# EAGLE schematic pchub (EAGLE 9.0.0)
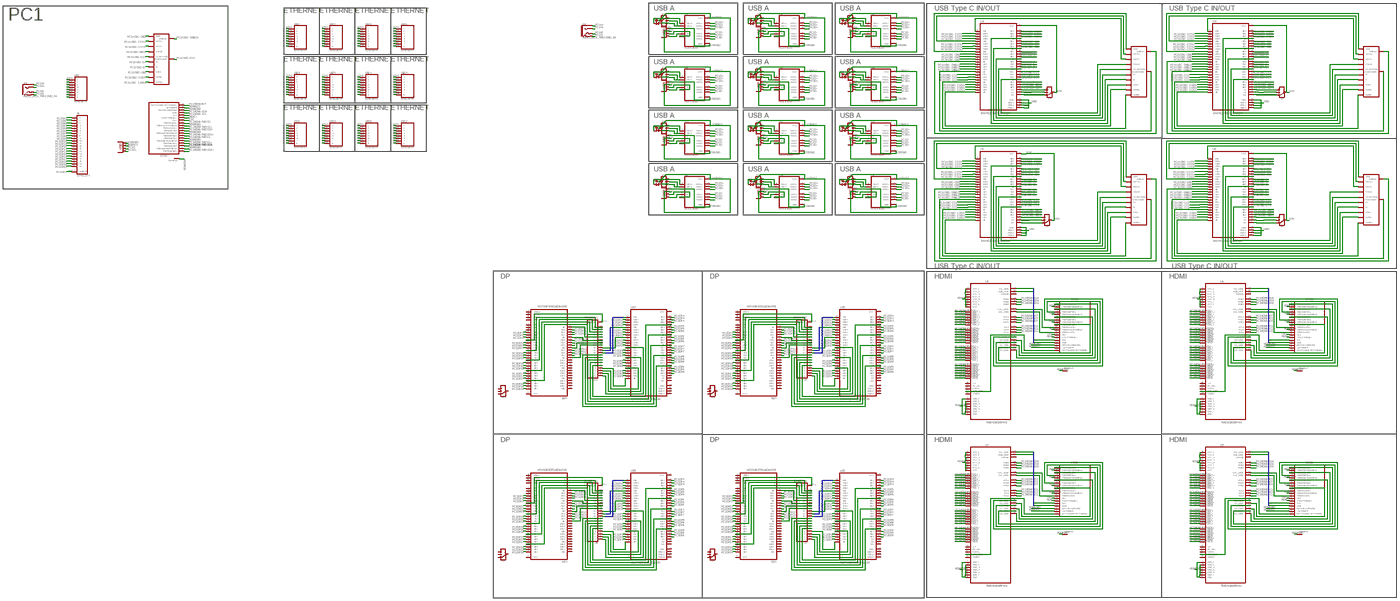
[diagram p0: schematic, sheet 1, overview]
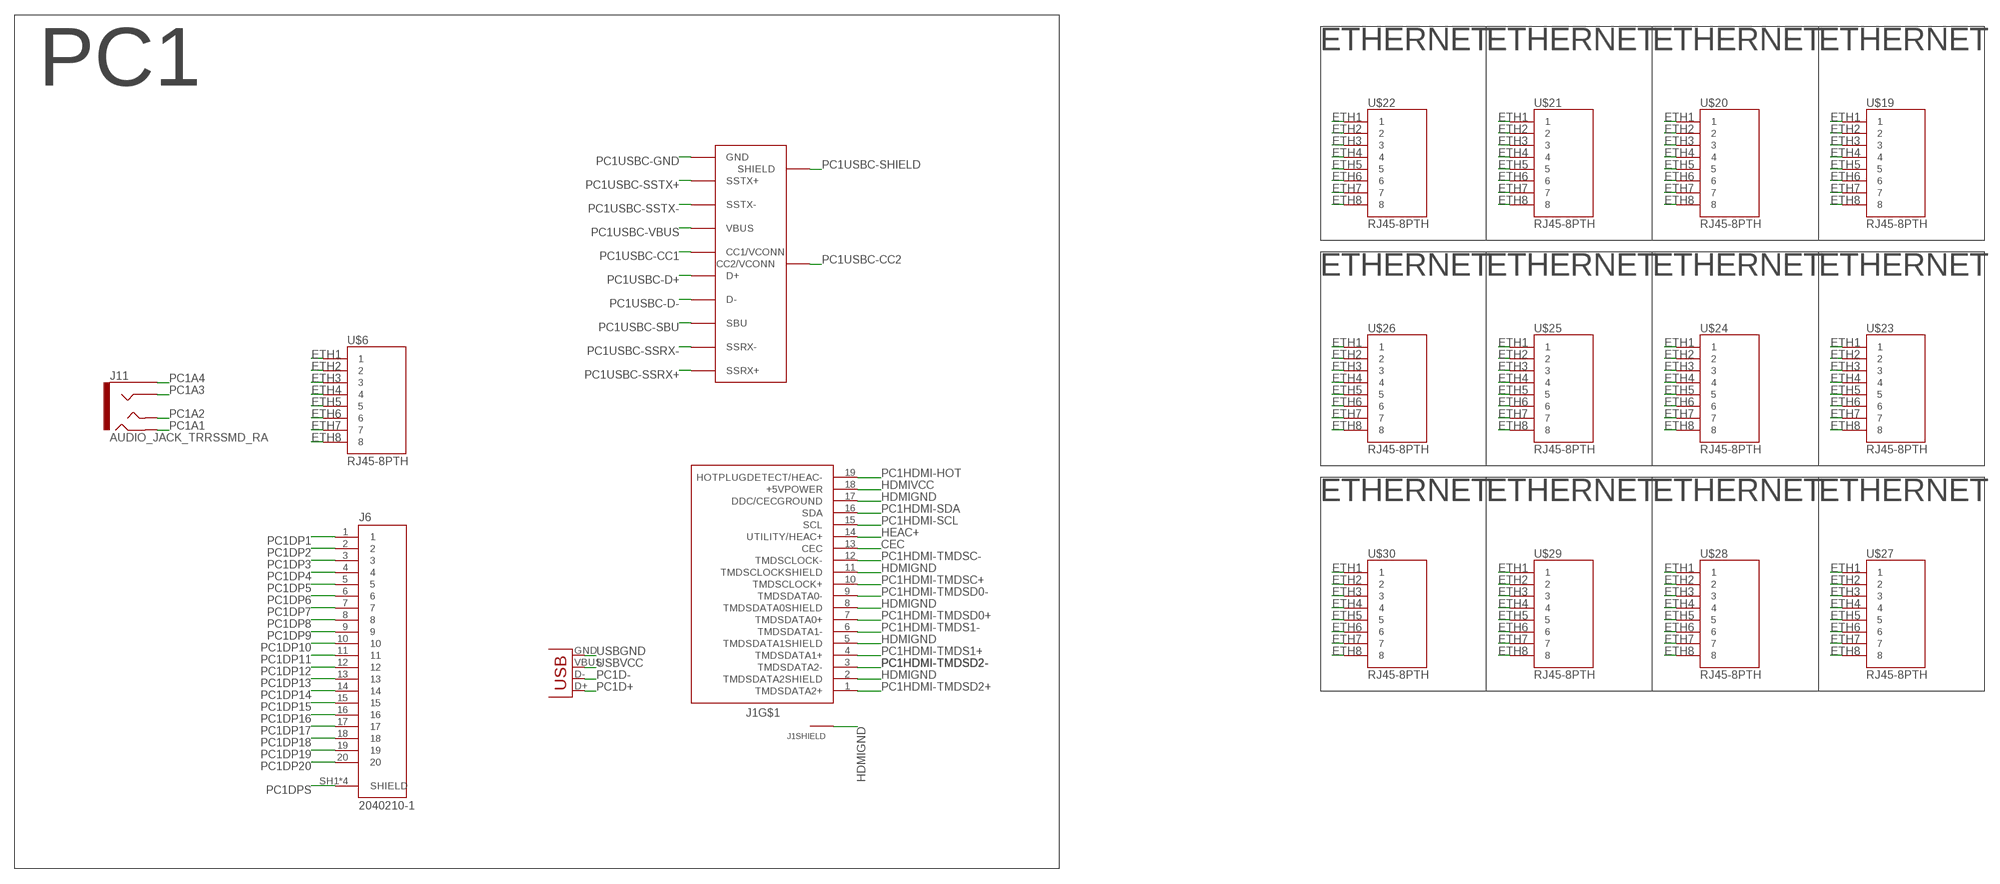
[diagram p1: schematic, sheet 1, part 1 of 5]
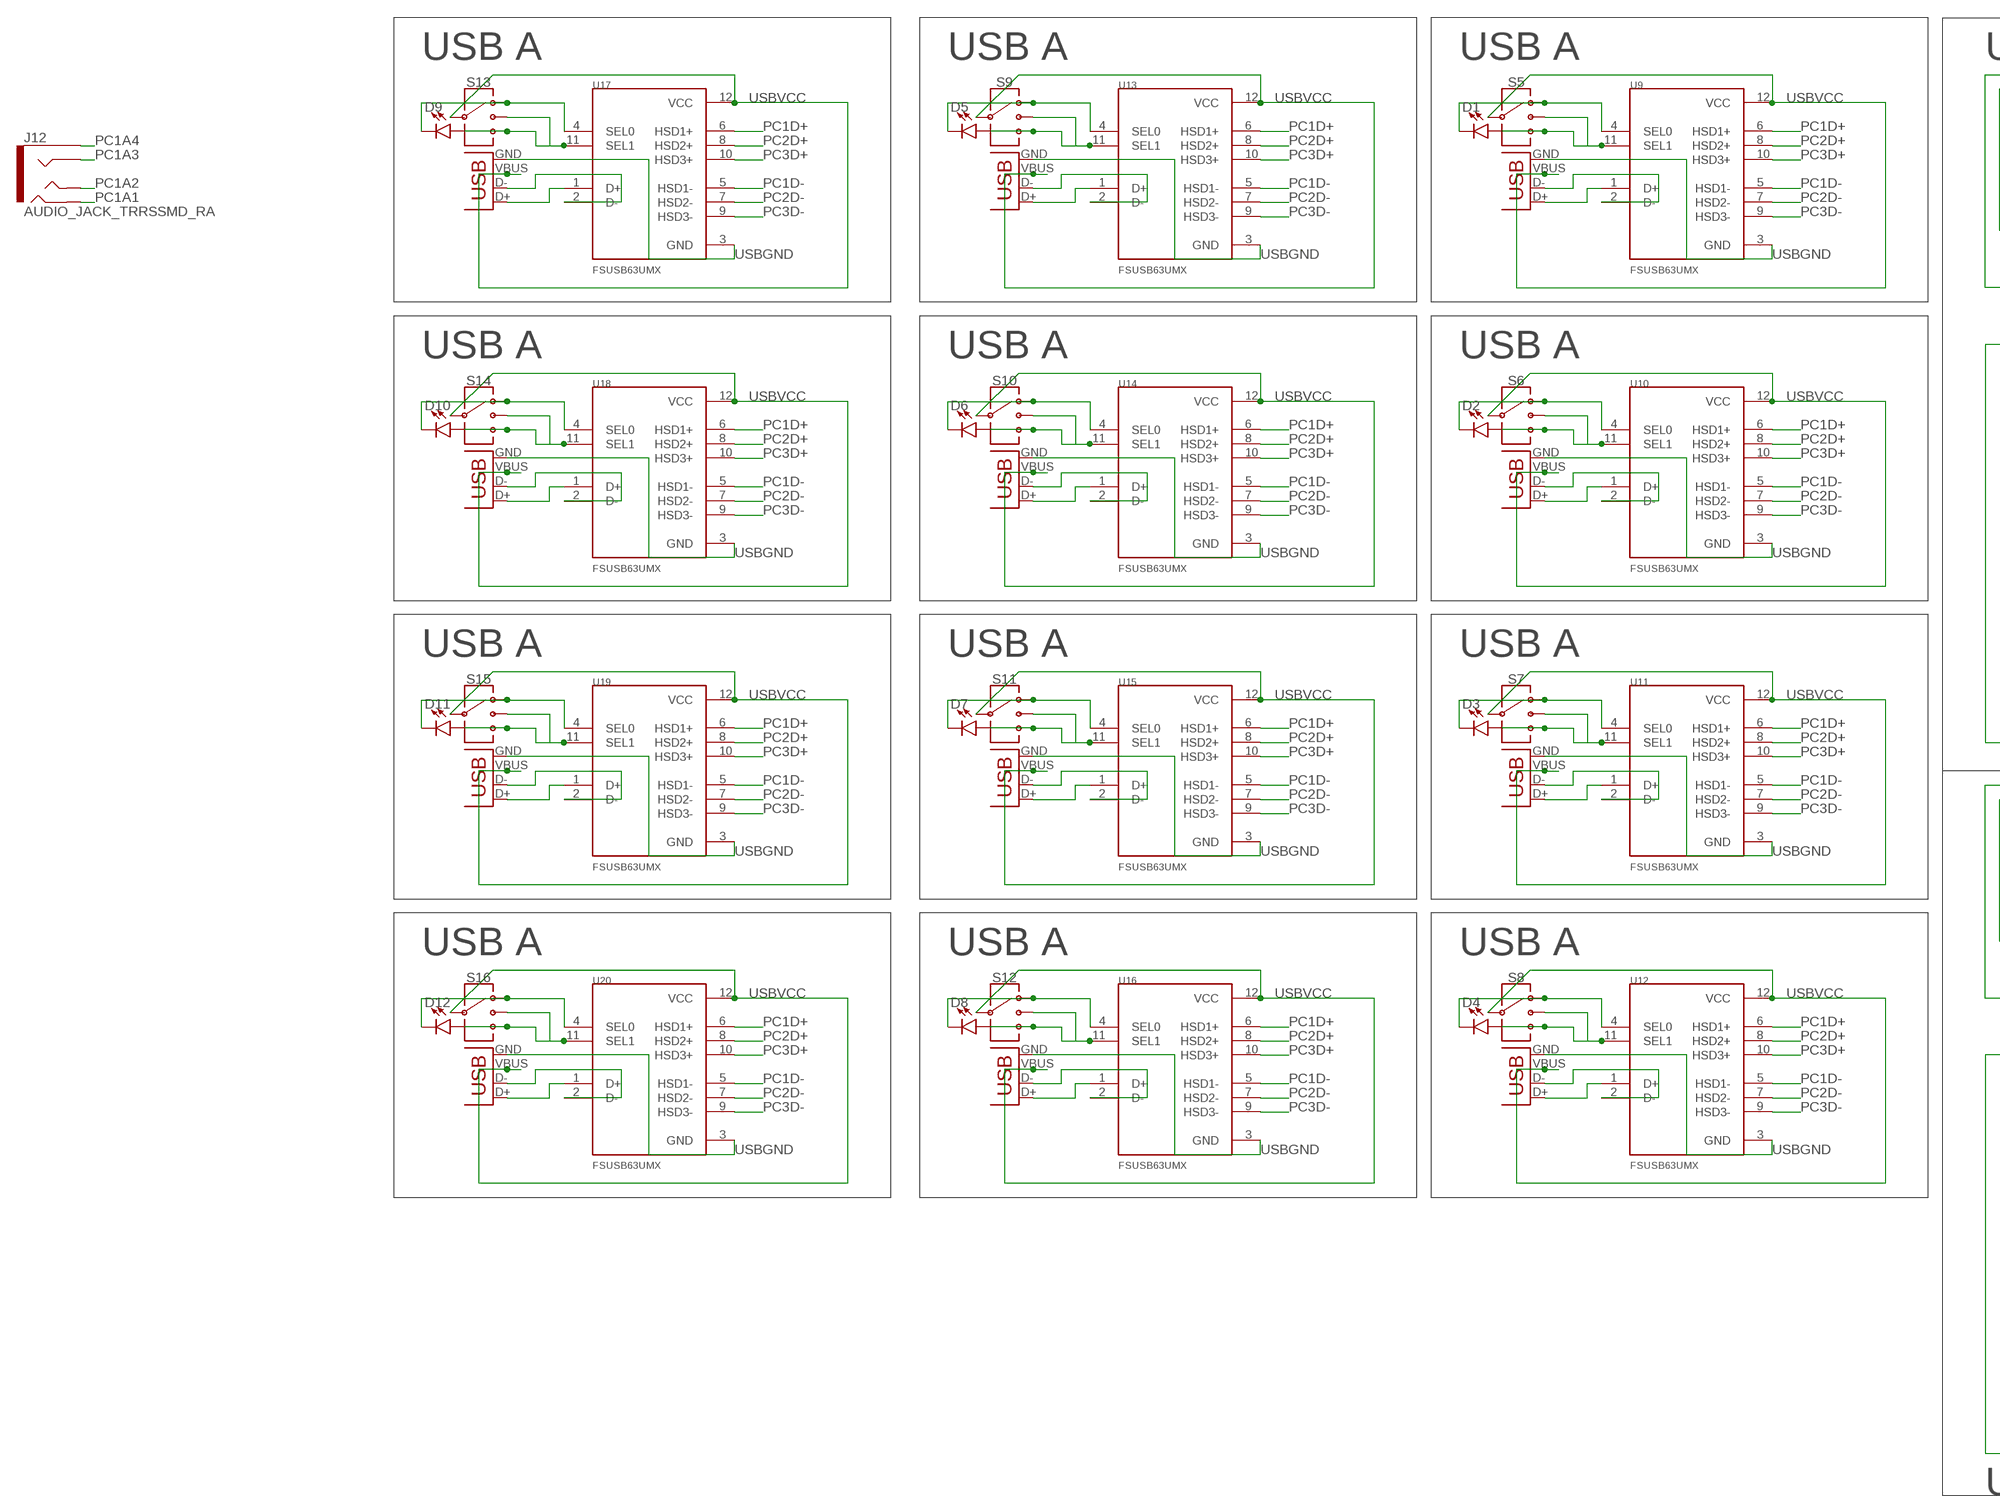
[diagram p2: schematic, sheet 1, part 2 of 5]
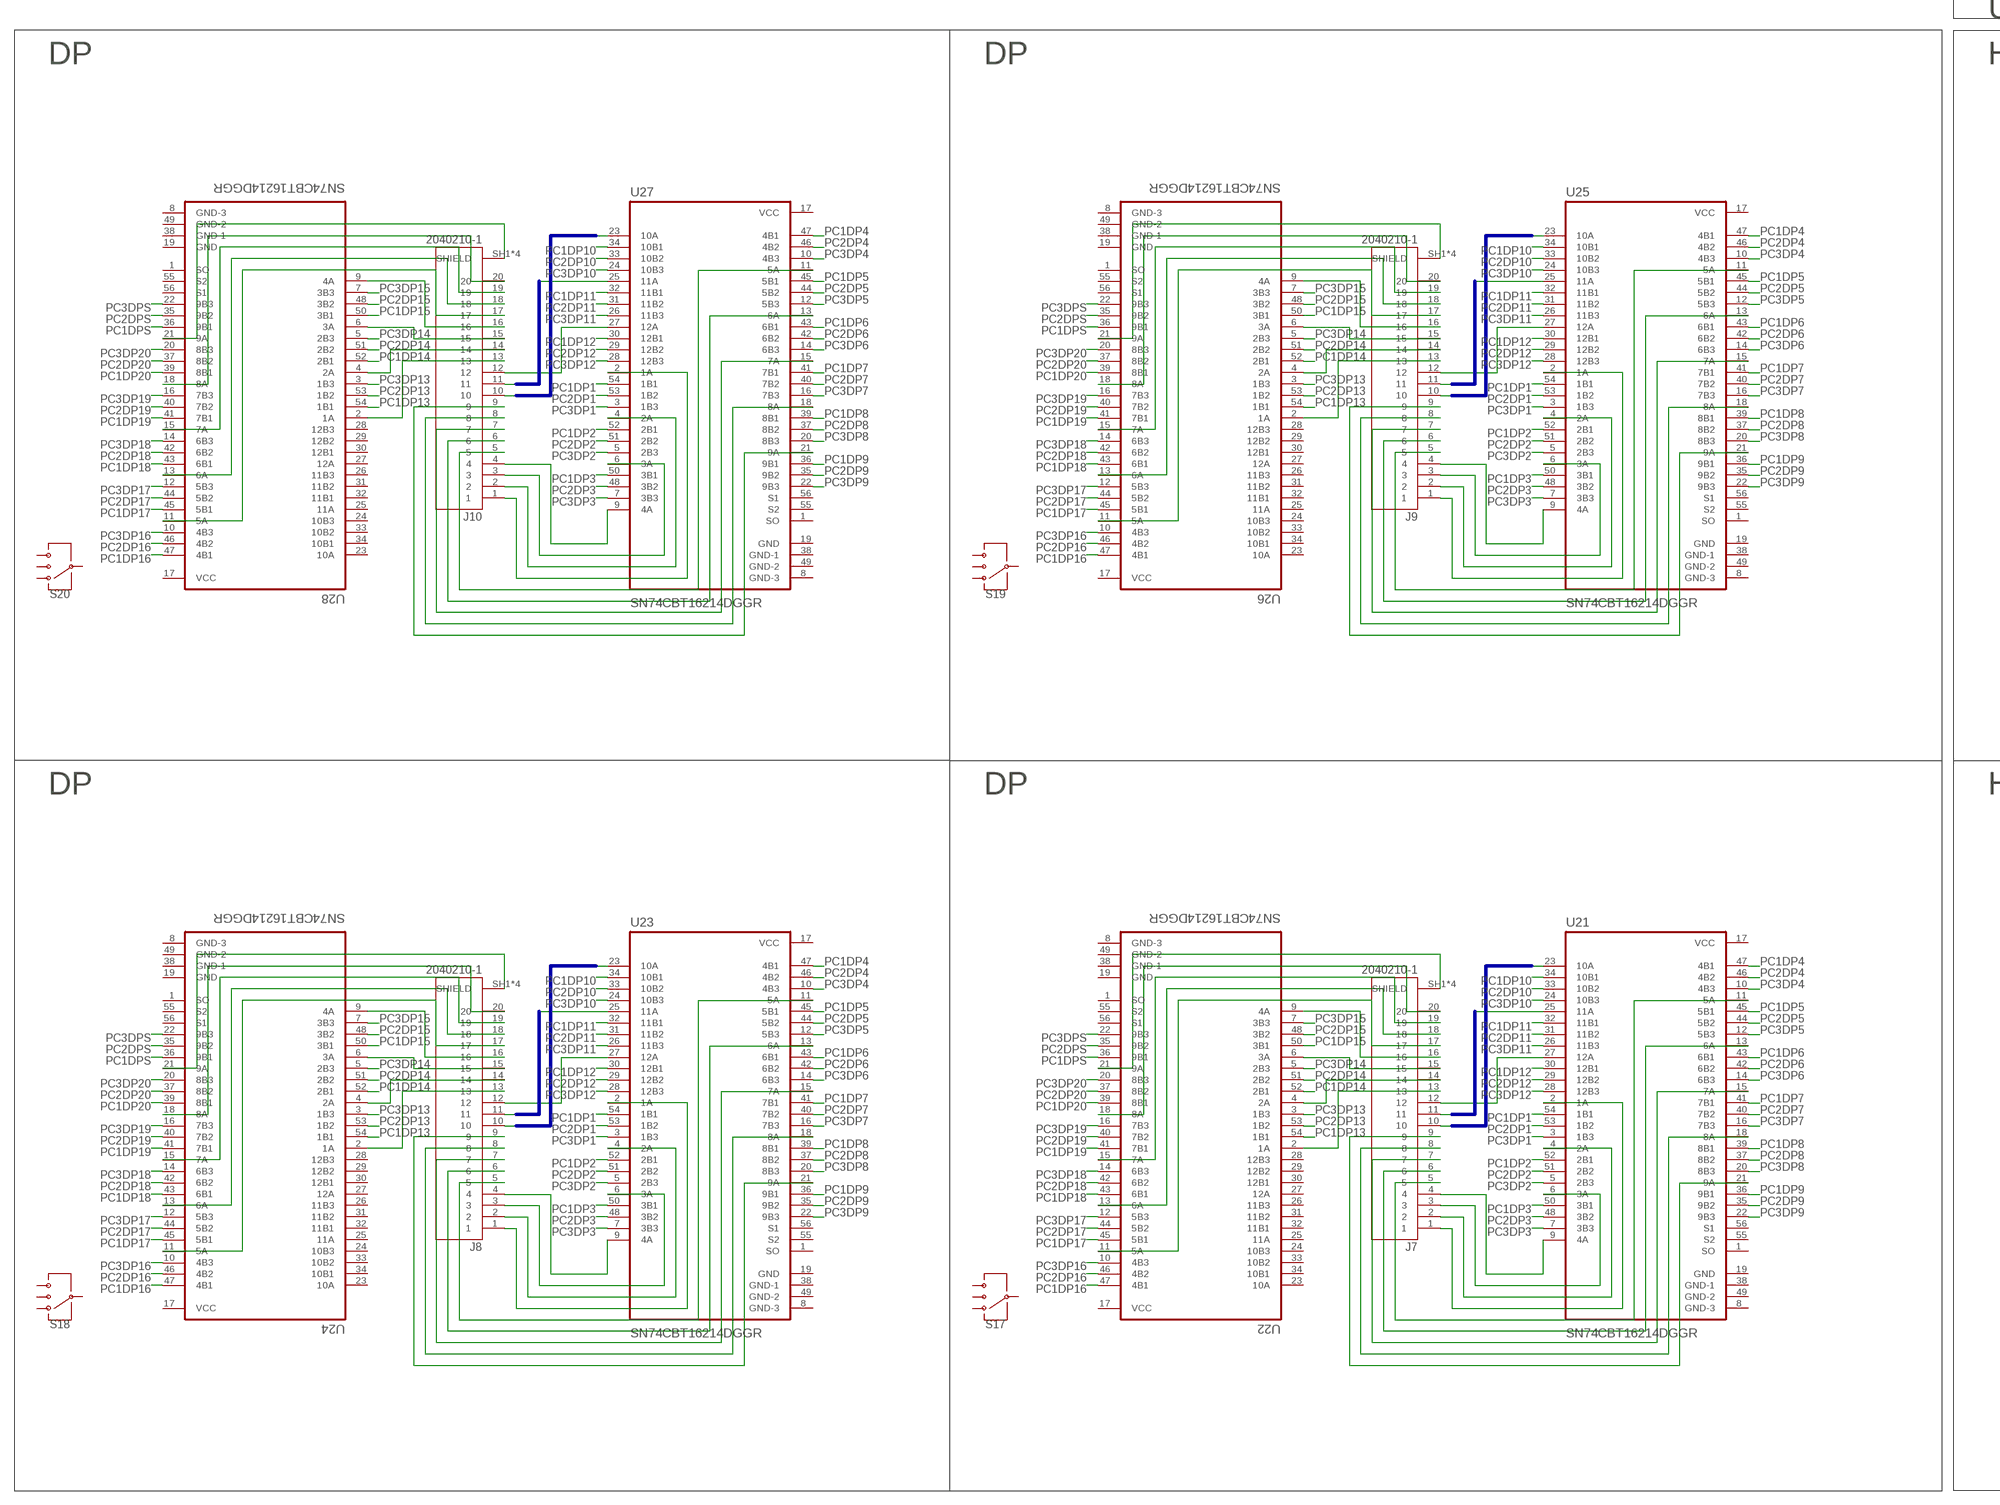
[diagram p3: schematic, sheet 1, part 3 of 5]
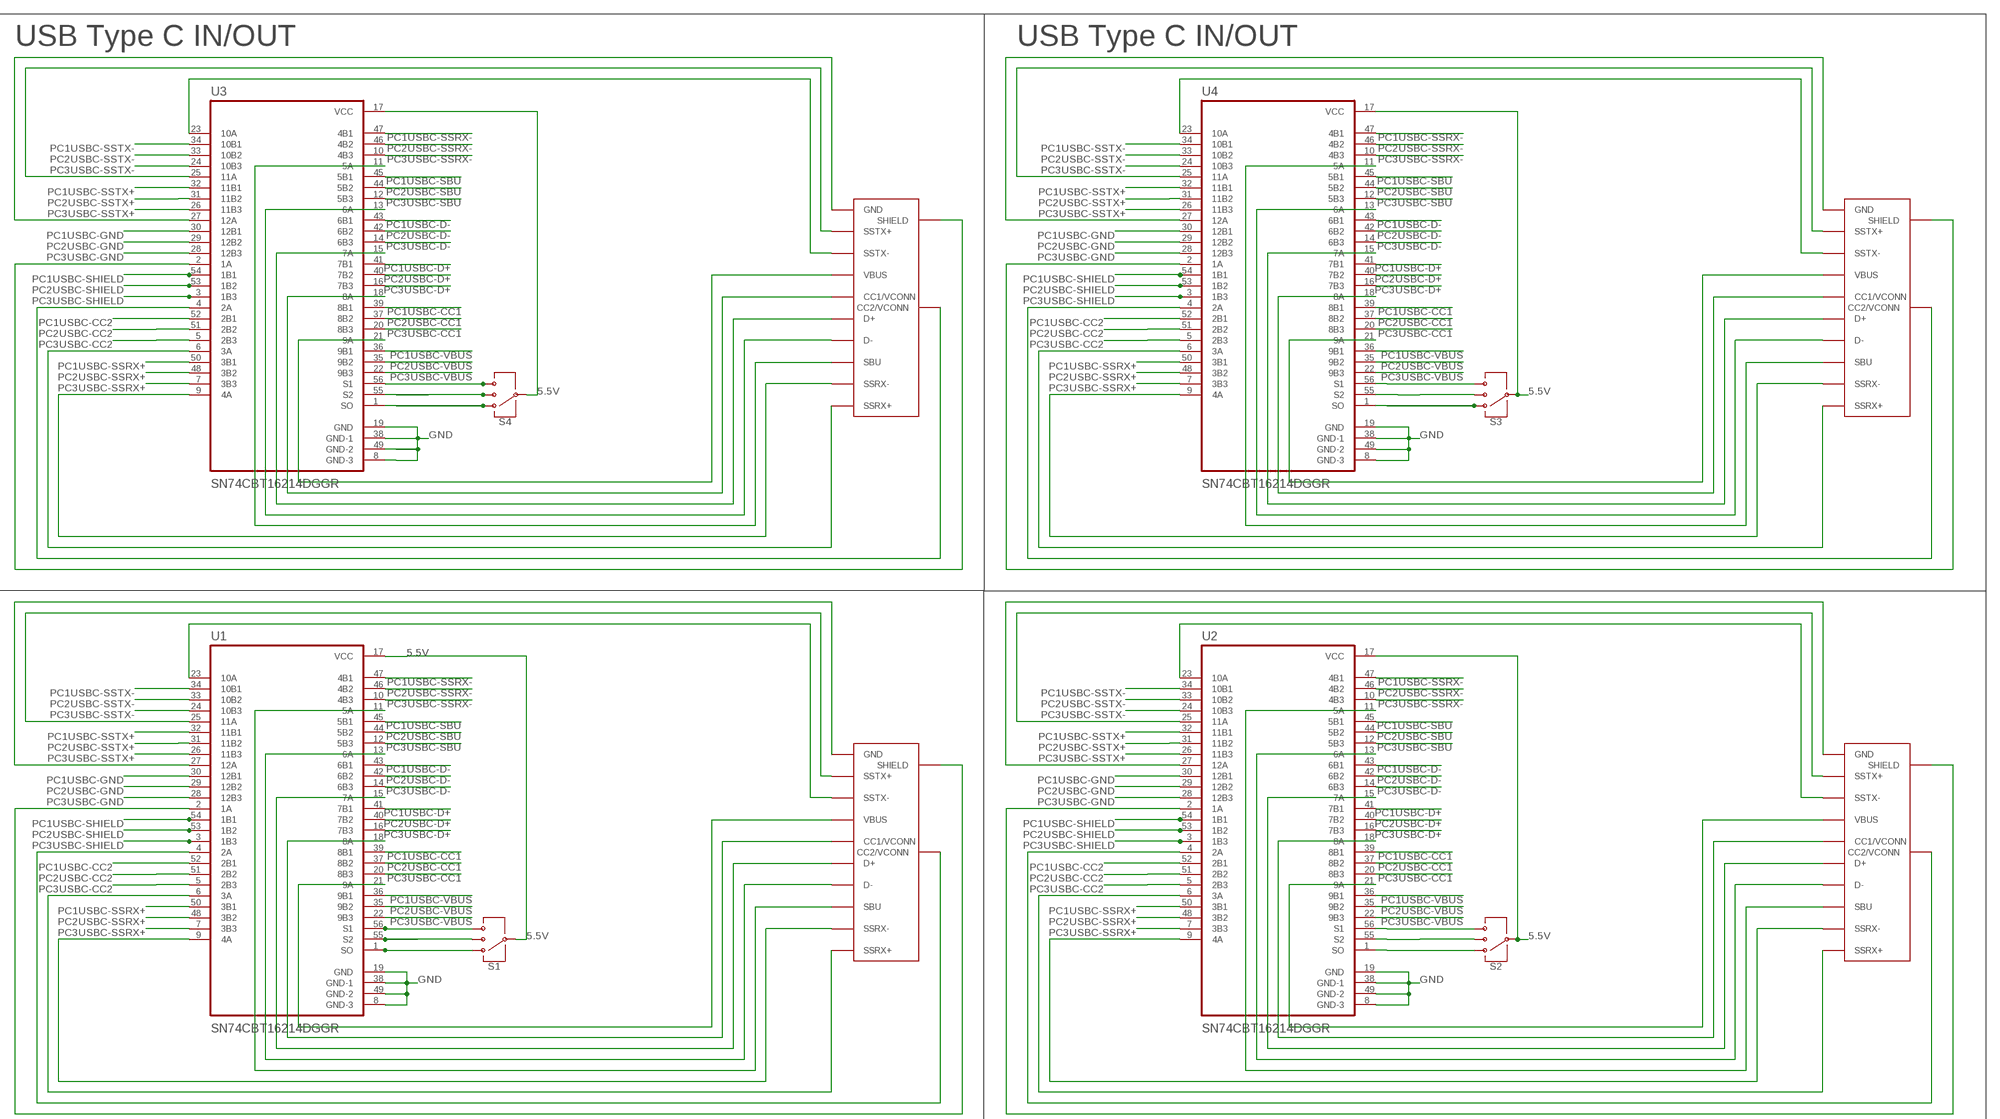
[diagram p4: schematic, sheet 1, part 4 of 5]
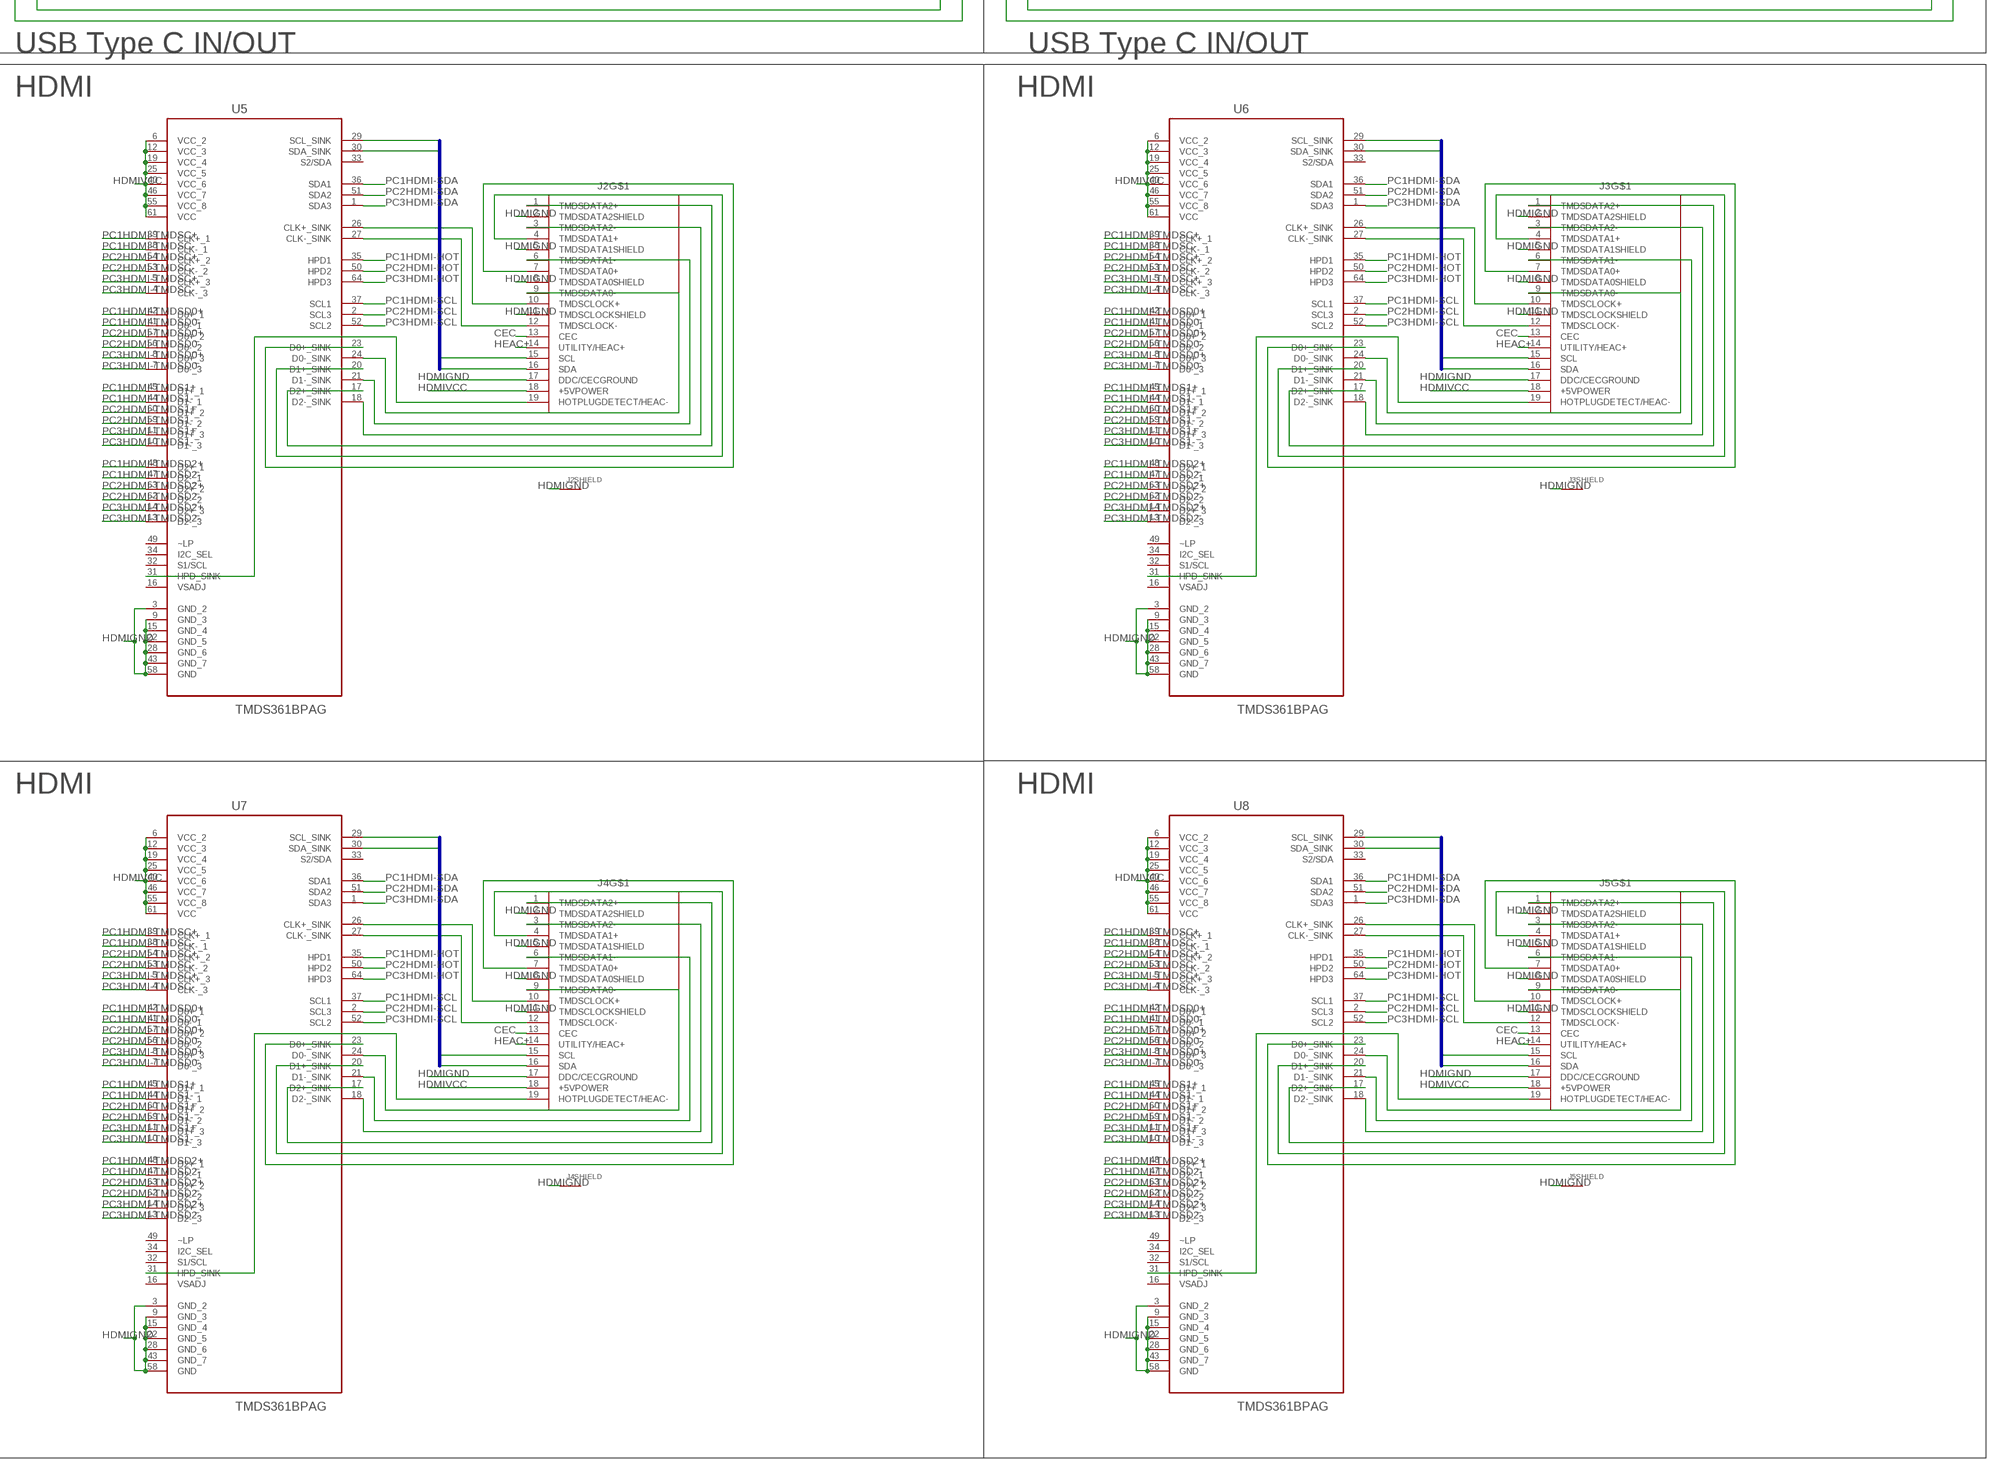
[diagram p5: schematic, sheet 1, part 5 of 5]

## Parts
D1  LED-FKIT-1206  [FKIT-LED-1206]
D2  LED-FKIT-1206  [FKIT-LED-1206]
D3  LED-FKIT-1206  [FKIT-LED-1206]
D4  LED-FKIT-1206  [FKIT-LED-1206]
D5  LED-FKIT-1206  [FKIT-LED-1206]
D6  LED-FKIT-1206  [FKIT-LED-1206]
D7  LED-FKIT-1206  [FKIT-LED-1206]
D8  LED-FKIT-1206  [FKIT-LED-1206]
D9  LED-FKIT-1206  [FKIT-LED-1206]
D10  LED-FKIT-1206  [FKIT-LED-1206]
D11  LED-FKIT-1206  [FKIT-LED-1206]
D12  LED-FKIT-1206  [FKIT-LED-1206]
J1  685119134923  [685119134923]
J2  685119134923  [685119134923]
J3  685119134923  [685119134923]
J4  685119134923  [685119134923]
J5  685119134923  [685119134923]
J6  2040210-1  [TE_2040210-1]
J7  2040210-1  [TE_2040210-1]
J8  2040210-1  [TE_2040210-1]
J9  2040210-1  [TE_2040210-1]
J10  2040210-1  [TE_2040210-1]
J11  AUDIO_JACK_TRRSSMD_RA  [AUDIO_JACK_3.5MM_TRRS_SMD_RA]
J12  AUDIO_JACK_TRRSSMD_RA  [AUDIO_JACK_3.5MM_TRRS_SMD_RA]
S1  SWITCH-SP3T-SMD  [SWITCH_SP3T_SMD]
S2  SWITCH-SP3T-SMD  [SWITCH_SP3T_SMD]
S3  SWITCH-SP3T-SMD  [SWITCH_SP3T_SMD]
S4  SWITCH-SP3T-SMD  [SWITCH_SP3T_SMD]
S5  SWITCH-SP3T-SMD  [SWITCH_SP3T_SMD]
S6  SWITCH-SP3T-SMD  [SWITCH_SP3T_SMD]
S7  SWITCH-SP3T-SMD  [SWITCH_SP3T_SMD]
S8  SWITCH-SP3T-SMD  [SWITCH_SP3T_SMD]
S9  SWITCH-SP3T-SMD  [SWITCH_SP3T_SMD]
S10  SWITCH-SP3T-SMD  [SWITCH_SP3T_SMD]
S11  SWITCH-SP3T-SMD  [SWITCH_SP3T_SMD]
S12  SWITCH-SP3T-SMD  [SWITCH_SP3T_SMD]
S13  SWITCH-SP3T-SMD  [SWITCH_SP3T_SMD]
S14  SWITCH-SP3T-SMD  [SWITCH_SP3T_SMD]
S15  SWITCH-SP3T-SMD  [SWITCH_SP3T_SMD]
S16  SWITCH-SP3T-SMD  [SWITCH_SP3T_SMD]
S17  SWITCH-SP3T-SMD  [SWITCH_SP3T_SMD]
S18  SWITCH-SP3T-SMD  [SWITCH_SP3T_SMD]
S19  SWITCH-SP3T-SMD  [SWITCH_SP3T_SMD]
S20  SWITCH-SP3T-SMD  [SWITCH_SP3T_SMD]
U1  SN74CBT16214DGGR  [SOP50P810X120-56N]
U2  SN74CBT16214DGGR  [SOP50P810X120-56N]
U3  SN74CBT16214DGGR  [SOP50P810X120-56N]
U4  SN74CBT16214DGGR  [SOP50P810X120-56N]
U5  TMDS361BPAG  [QFP50P1200X1200X120-64N]
U6  TMDS361BPAG  [QFP50P1200X1200X120-64N]
U7  TMDS361BPAG  [QFP50P1200X1200X120-64N]
U8  TMDS361BPAG  [QFP50P1200X1200X120-64N]
U9  FSUSB63UMX  [QFN40P180X180X55-12N]
U10  FSUSB63UMX  [QFN40P180X180X55-12N]
U11  FSUSB63UMX  [QFN40P180X180X55-12N]
U12  FSUSB63UMX  [QFN40P180X180X55-12N]
U13  FSUSB63UMX  [QFN40P180X180X55-12N]
U14  FSUSB63UMX  [QFN40P180X180X55-12N]
U15  FSUSB63UMX  [QFN40P180X180X55-12N]
U16  FSUSB63UMX  [QFN40P180X180X55-12N]
U17  FSUSB63UMX  [QFN40P180X180X55-12N]
U18  FSUSB63UMX  [QFN40P180X180X55-12N]
U19  FSUSB63UMX  [QFN40P180X180X55-12N]
U20  FSUSB63UMX  [QFN40P180X180X55-12N]
U21  SN74CBT16214DGGR  [SOP50P810X120-56N]
U22  SN74CBT16214DGGR  [SOP50P810X120-56N]
U23  SN74CBT16214DGGR  [SOP50P810X120-56N]
U24  SN74CBT16214DGGR  [SOP50P810X120-56N]
U25  SN74CBT16214DGGR  [SOP50P810X120-56N]
U26  SN74CBT16214DGGR  [SOP50P810X120-56N]
U27  SN74CBT16214DGGR  [SOP50P810X120-56N]
U28  SN74CBT16214DGGR  [SOP50P810X120-56N]
U$1  USB-TYPE-C  [USB-TYPE-C-SMT]
U$2  USB-TYPE-C  [USB-TYPE-C-SMT]
U$3  USB-TYPE-C  [USB-TYPE-C-SMT]
U$4  USB-TYPE-C  [USB-TYPE-C-SMT]
U$5  USB-TYPE-C  [USB-TYPE-C-SMT]
U$6  RJ45-8PTH  [RJ45-8]
U$19  RJ45-8PTH  [RJ45-8]
U$20  RJ45-8PTH  [RJ45-8]
U$21  RJ45-8PTH  [RJ45-8]
U$22  RJ45-8PTH  [RJ45-8]
U$23  RJ45-8PTH  [RJ45-8]
U$24  RJ45-8PTH  [RJ45-8]
U$25  RJ45-8PTH  [RJ45-8]
U$26  RJ45-8PTH  [RJ45-8]
U$27  RJ45-8PTH  [RJ45-8]
U$28  RJ45-8PTH  [RJ45-8]
U$29  RJ45-8PTH  [RJ45-8]
U$30  RJ45-8PTH  [RJ45-8]
X1  USB  [USB-A-S-NOSILK-FEMALE]
X2  USB  [USB-A-S-NOSILK-FEMALE]
X3  USB  [USB-A-S-NOSILK-FEMALE]
X4  USB  [USB-A-S-NOSILK-FEMALE]
X5  USB  [USB-A-S-NOSILK-FEMALE]
X6  USB  [USB-A-S-NOSILK-FEMALE]
X7  USB  [USB-A-S-NOSILK-FEMALE]
X8  USB  [USB-A-S-NOSILK-FEMALE]
X9  USB  [USB-A-S-NOSILK-FEMALE]
X10  USB  [USB-A-S-NOSILK-FEMALE]
X11  USB  [USB-A-S-NOSILK-FEMALE]
X12  USB  [USB-A-S-NOSILK-FEMALE]
X13  USB  [USB-A-S-NOSILK-FEMALE]

## Nets
5.5V: S1.3 S2.3 S3.3 S4.3 U1.17(VCC) U2.17(VCC) U3.17(VCC) U4.17(VCC)
B$1: U21.23(10A) U23.23(10A) U25.23(10A) U27.23(10A)
B$2: U21.25(11A) U23.25(11A) U25.25(11A) U27.25(11A)
CEC: J1.13(CEC) J2.13(CEC) J3.13(CEC) J4.13(CEC) J5.13(CEC)
ETH1: U$6.1 U$19.1 U$20.1 U$21.1 U$22.1 U$23.1 U$24.1 U$25.1 U$26.1 U$27.1 U$28.1 U$29.1 U$30.1
ETH2: U$6.2 U$19.2 U$20.2 U$21.2 U$22.2 U$23.2 U$24.2 U$25.2 U$26.2 U$27.2 U$28.2 U$29.2 U$30.2
ETH3: U$6.3 U$19.3 U$20.3 U$21.3 U$22.3 U$23.3 U$24.3 U$25.3 U$26.3 U$27.3 U$28.3 U$29.3 U$30.3
ETH4: U$6.4 U$19.4 U$20.4 U$21.4 U$22.4 U$23.4 U$24.4 U$25.4 U$26.4 U$27.4 U$28.4 U$29.4 U$30.4
ETH5: U$6.5 U$19.5 U$20.5 U$21.5 U$22.5 U$23.5 U$24.5 U$25.5 U$26.5 U$27.5 U$28.5 U$29.5 U$30.5
ETH6: U$6.6 U$19.6 U$20.6 U$21.6 U$22.6 U$23.6 U$24.6 U$25.6 U$26.6 U$27.6 U$28.6 U$29.6 U$30.6
ETH7: U$6.7 U$19.7 U$20.7 U$21.7 U$22.7 U$23.7 U$24.7 U$25.7 U$26.7 U$27.7 U$28.7 U$29.7 U$30.7
ETH8: U$6.8 U$19.8 U$20.8 U$21.8 U$22.8 U$23.8 U$24.8 U$25.8 U$26.8 U$27.8 U$28.8 U$29.8 U$30.8
GND: U1.8(GND-3) U1.19(GND) U1.38(GND-1) U1.49(GND-2) U2.8(GND-3) U2.19(GND) U2.38(GND-1) U2.49(GND-2) U3.8(GND-3) U3.19(GND) U3.38(GND-1) U3.49(GND-2) U4.8(GND-3) U4.19(GND) U4.38(GND-1) U4.49(GND-2)
HDMIGND: J1.2(TMDSDATA2SHIELD) J1.5(TMDSDATA1SHIELD) J1.8(TMDSDATA0SHIELD) J1.11(TMDSCLOCKSHIELD) J1.17(DDC/CECGROUND) J1.SHELL1(SHIELD:SHIELD) J1.SHELL2(SHIELD:SHIELD) J1.SHELL3(SHIELD:SHIELD) J1.SHELL(SHIELD:SHIELD) J2.2(TMDSDATA2SHIELD) J2.5(TMDSDATA1SHIELD) J2.8(TMDSDATA0SHIELD) J2.11(TMDSCLOCKSHIELD) J2.17(DDC/CECGROUND) J2.SHELL1(SHIELD:SHIELD) J2.SHELL2(SHIELD:SHIELD) J2.SHELL3(SHIELD:SHIELD) J2.SHELL(SHIELD:SHIELD) J3.2(TMDSDATA2SHIELD) J3.5(TMDSDATA1SHIELD) J3.8(TMDSDATA0SHIELD) J3.11(TMDSCLOCKSHIELD) J3.17(DDC/CECGROUND) J3.SHELL1(SHIELD:SHIELD) J3.SHELL2(SHIELD:SHIELD) J3.SHELL3(SHIELD:SHIELD) J3.SHELL(SHIELD:SHIELD) J4.2(TMDSDATA2SHIELD) J4.5(TMDSDATA1SHIELD) J4.8(TMDSDATA0SHIELD) J4.11(TMDSCLOCKSHIELD) J4.17(DDC/CECGROUND) J4.SHELL1(SHIELD:SHIELD) J4.SHELL2(SHIELD:SHIELD) J4.SHELL3(SHIELD:SHIELD) J4.SHELL(SHIELD:SHIELD) J5.2(TMDSDATA2SHIELD) J5.5(TMDSDATA1SHIELD) J5.8(TMDSDATA0SHIELD) J5.11(TMDSCLOCKSHIELD) J5.17(DDC/CECGROUND) J5.SHELL1(SHIELD:SHIELD) J5.SHELL2(SHIELD:SHIELD) J5.SHELL3(SHIELD:SHIELD) J5.SHELL(SHIELD:SHIELD) U5.3(GND_2) U5.9(GND_3) U5.15(GND_4) U5.22(GND_5) U5.28(GND_6) U5.43(GND_7) U5.58(GND) U6.3(GND_2) U6.9(GND_3) U6.15(GND_4) U6.22(GND_5) U6.28(GND_6) U6.43(GND_7) U6.58(GND) U7.3(GND_2) U7.9(GND_3) U7.15(GND_4) U7.22(GND_5) U7.28(GND_6) U7.43(GND_7) U7.58(GND) U8.3(GND_2) U8.9(GND_3) U8.15(GND_4) U8.22(GND_5) U8.28(GND_6) U8.43(GND_7) U8.58(GND)
HDMIVCC: J1.18(+5VPOWER) J2.18(+5VPOWER) J3.18(+5VPOWER) J4.18(+5VPOWER) J5.18(+5VPOWER) U5.6(VCC_2) U5.12(VCC_3) U5.19(VCC_4) U5.25(VCC_5) U5.40(VCC_6) U5.46(VCC_7) U5.55(VCC_8) U5.61(VCC) U6.6(VCC_2) U6.12(VCC_3) U6.19(VCC_4) U6.25(VCC_5) U6.40(VCC_6) U6.46(VCC_7) U6.55(VCC_8) U6.61(VCC) U7.6(VCC_2) U7.12(VCC_3) U7.19(VCC_4) U7.25(VCC_5) U7.40(VCC_6) U7.46(VCC_7) U7.55(VCC_8) U7.61(VCC) U8.6(VCC_2) U8.12(VCC_3) U8.19(VCC_4) U8.25(VCC_5) U8.40(VCC_6) U8.46(VCC_7) U8.55(VCC_8) U8.61(VCC)
HEAC+: J1.14(UTILITY/HEAC+) J2.14(UTILITY/HEAC+) J3.14(UTILITY/HEAC+) J4.14(UTILITY/HEAC+) J5.14(UTILITY/HEAC+)
N$1: U2.18(8A) U$2.5(CC1/VCONN)
N$2: U2.23(10A) U$2.3(SSTX-) U$2.B3(SSTX-)
N$3: U2.25(11A) U$2.2(SSTX+) U$2.B2(SSTX+)
N$4: U2.27(12A) U$2.1(GND) U$2.12(GND) U$2.B1(GND) U$2.B12(GND)
N$5: U2.2(1A) U$2.P$1(SHIELD) U$2.P$2(SHIELD) U$2.P$3(SHIELD) U$2.P$4(SHIELD) U$2.P$5(SHIELD) U$2.P$6(SHIELD) U$2.P$7(SHIELD) U$2.P$8(SHIELD) U$2.P$9(SHIELD) U$2.P$10(SHIELD) U$2.P$11(SHIELD) U$2.P$12(SHIELD) U$2.P$13(SHIELD) U$2.P$14(SHIELD) U$2.P$15(SHIELD) U$2.P$16(SHIELD) U$2.P$17(SHIELD) U$2.P$18(SHIELD) U$2.P$19(SHIELD) U$2.P$20(SHIELD) U$2.P$21(SHIELD) U$2.P$22(SHIELD) U$2.P$23(SHIELD) U$2.P$24(SHIELD) U$2.P$25(SHIELD) U$2.P$26(SHIELD) U$2.P$27(SHIELD) U$2.P$28(SHIELD)
N$6: U2.4(2A) U$2.B5(CC2/VCONN)
N$7: U2.15(7A) U$2.6(D+) U$2.B6(D+)
N$8: U2.13(6A) U$2.7(D-) U$2.B7(D-)
N$9: U2.11(5A) U$2.8(SBU) U$2.B8(SBU)
N$10: U2.9(4A) U$2.10(SSRX-) U$2.B10(SSRX-)
N$11: U2.6(3A) U$2.11(SSRX+) U$2.B11(SSRX+)
N$12: U3.18(8A) U$4.5(CC1/VCONN)
N$13: U3.23(10A) U$4.3(SSTX-) U$4.B3(SSTX-)
N$14: U3.25(11A) U$4.2(SSTX+) U$4.B2(SSTX+)
N$15: U3.27(12A) U$4.1(GND) U$4.12(GND) U$4.B1(GND) U$4.B12(GND)
N$16: U3.2(1A) U$4.P$1(SHIELD) U$4.P$2(SHIELD) U$4.P$3(SHIELD) U$4.P$4(SHIELD) U$4.P$5(SHIELD) U$4.P$6(SHIELD) U$4.P$7(SHIELD) U$4.P$8(SHIELD) U$4.P$9(SHIELD) U$4.P$10(SHIELD) U$4.P$11(SHIELD) U$4.P$12(SHIELD) U$4.P$13(SHIELD) U$4.P$14(SHIELD) U$4.P$15(SHIELD) U$4.P$16(SHIELD) U$4.P$17(SHIELD) U$4.P$18(SHIELD) U$4.P$19(SHIELD) U$4.P$20(SHIELD) U$4.P$21(SHIELD) U$4.P$22(SHIELD) U$4.P$23(SHIELD) U$4.P$24(SHIELD) U$4.P$25(SHIELD) U$4.P$26(SHIELD) U$4.P$27(SHIELD) U$4.P$28(SHIELD)
N$17: U3.4(2A) U$4.B5(CC2/VCONN)
N$18: U3.15(7A) U$4.6(D+) U$4.B6(D+)
N$19: U3.13(6A) U$4.7(D-) U$4.B7(D-)
N$20: U3.11(5A) U$4.8(SBU) U$4.B8(SBU)
N$21: U3.9(4A) U$4.10(SSRX-) U$4.B10(SSRX-)
N$22: U3.6(3A) U$4.11(SSRX+) U$4.B11(SSRX+)
N$23: U4.18(8A) U$5.5(CC1/VCONN)
N$24: U4.23(10A) U$5.3(SSTX-) U$5.B3(SSTX-)
N$25: U4.25(11A) U$5.2(SSTX+) U$5.B2(SSTX+)
N$26: U4.27(12A) U$5.1(GND) U$5.12(GND) U$5.B1(GND) U$5.B12(GND)
N$27: U4.2(1A) U$5.P$1(SHIELD) U$5.P$2(SHIELD) U$5.P$3(SHIELD) U$5.P$4(SHIELD) U$5.P$5(SHIELD) U$5.P$6(SHIELD) U$5.P$7(SHIELD) U$5.P$8(SHIELD) U$5.P$9(SHIELD) U$5.P$10(SHIELD) U$5.P$11(SHIELD) U$5.P$12(SHIELD) U$5.P$13(SHIELD) U$5.P$14(SHIELD) U$5.P$15(SHIELD) U$5.P$16(SHIELD) U$5.P$17(SHIELD) U$5.P$18(SHIELD) U$5.P$19(SHIELD) U$5.P$20(SHIELD) U$5.P$21(SHIELD) U$5.P$22(SHIELD) U$5.P$23(SHIELD) U$5.P$24(SHIELD) U$5.P$25(SHIELD) U$5.P$26(SHIELD) U$5.P$27(SHIELD) U$5.P$28(SHIELD)
N$28: U4.4(2A) U$5.B5(CC2/VCONN)
N$29: U4.15(7A) U$5.6(D+) U$5.B6(D+)
N$30: U4.13(6A) U$5.7(D-) U$5.B7(D-)
N$31: U4.11(5A) U$5.8(SBU) U$5.B8(SBU)
N$32: U4.9(4A) U$5.10(SSRX-) U$5.B10(SSRX-)
N$33: U4.6(3A) U$5.11(SSRX+) U$5.B11(SSRX+)
N$34: S2.4 U2.56(S1)
N$35: S1.4 U1.56(S1)
N$36: S1.2 U1.55(S2)
N$37: S1.1 U1.1(SO)
N$38: S2.2 U2.55(S2)
N$39: S2.1 U2.1(SO)
N$40: S3.4 U4.56(S1)
N$41: S3.2 U4.55(S2)
N$42: S3.1 U4.1(SO)
N$43: S4.4 U3.56(S1)
N$44: S4.2 U3.55(S2)
N$45: S4.1 U3.1(SO)
N$46: J2.3(TMDSDATA2-) U5.18(D2-_SINK)
N$47: J2.1(TMDSDATA2+) U5.17(D2+_SINK)
N$48: J2.6(TMDSDATA1-) U5.21(D1-_SINK)
N$49: J2.4(TMDSDATA1+) U5.20(D1+_SINK)
N$50: J2.9(TMDSDATA0-) U5.24(D0-_SINK)
N$51: J2.7(TMDSDATA0+) U5.23(D0+_SINK)
N$52: J2.12(TMDSCLOCK-) U5.27(CLK-_SINK)
N$53: J2.10(TMDSCLOCK+) U5.26(CLK+_SINK)
N$54: J2.19(HOTPLUGDETECT/HEAC-) U5.31(HPD_SINK)
N$55: J3.3(TMDSDATA2-) U6.18(D2-_SINK)
N$56: J3.1(TMDSDATA2+) U6.17(D2+_SINK)
N$57: J3.6(TMDSDATA1-) U6.21(D1-_SINK)
N$58: J3.4(TMDSDATA1+) U6.20(D1+_SINK)
N$59: J3.9(TMDSDATA0-) U6.24(D0-_SINK)
N$60: J3.7(TMDSDATA0+) U6.23(D0+_SINK)
N$61: J3.12(TMDSCLOCK-) U6.27(CLK-_SINK)
N$62: J3.10(TMDSCLOCK+) U6.26(CLK+_SINK)
N$63: J3.19(HOTPLUGDETECT/HEAC-) U6.31(HPD_SINK)
N$64: J4.3(TMDSDATA2-) U7.18(D2-_SINK)
N$65: J4.1(TMDSDATA2+) U7.17(D2+_SINK)
N$66: J4.6(TMDSDATA1-) U7.21(D1-_SINK)
N$67: J4.4(TMDSDATA1+) U7.20(D1+_SINK)
N$68: J4.9(TMDSDATA0-) U7.24(D0-_SINK)
N$69: J4.7(TMDSDATA0+) U7.23(D0+_SINK)
N$70: J4.12(TMDSCLOCK-) U7.27(CLK-_SINK)
N$71: J4.10(TMDSCLOCK+) U7.26(CLK+_SINK)
N$72: J4.19(HOTPLUGDETECT/HEAC-) U7.31(HPD_SINK)
N$73: J5.3(TMDSDATA2-) U8.18(D2-_SINK)
N$74: J5.1(TMDSDATA2+) U8.17(D2+_SINK)
N$75: J5.6(TMDSDATA1-) U8.21(D1-_SINK)
N$76: J5.4(TMDSDATA1+) U8.20(D1+_SINK)
N$77: J5.9(TMDSDATA0-) U8.24(D0-_SINK)
N$78: J5.7(TMDSDATA0+) U8.23(D0+_SINK)
N$79: J5.12(TMDSCLOCK-) U8.27(CLK-_SINK)
N$80: J5.10(TMDSCLOCK+) U8.26(CLK+_SINK)
N$81: J5.19(HOTPLUGDETECT/HEAC-) U8.31(HPD_SINK)
N$82: U9.2(D-) X1.D-
N$83: U9.1(D+) X1.D+
N$84: D1.C S5.1 U9.4(SEL0)
N$85: U10.2(D-) X3.D-
N$86: U10.1(D+) X3.D+
N$87: D1.A S5.2 S5.4 U9.11(SEL1)
N$88: D2.C S6.1 U10.4(SEL0)
N$89: D2.A S6.2 S6.4 U10.11(SEL1)
N$90: U11.2(D-) X4.D-
N$91: U11.1(D+) X4.D+
N$92: D3.C S7.1 U11.4(SEL0)
N$93: D3.A S7.2 S7.4 U11.11(SEL1)
N$94: U12.2(D-) X5.D-
N$95: U12.1(D+) X5.D+
N$96: D4.C S8.1 U12.4(SEL0)
N$97: D4.A S8.2 S8.4 U12.11(SEL1)
N$98: U13.2(D-) X6.D-
N$99: U13.1(D+) X6.D+
N$100: D5.C S9.1 U13.4(SEL0)
N$101: D5.A S9.2 S9.4 U13.11(SEL1)
N$102: U14.2(D-) X7.D-
N$103: U14.1(D+) X7.D+
N$104: D6.C S10.1 U14.4(SEL0)
N$105: D6.A S10.2 S10.4 U14.11(SEL1)
N$106: U15.2(D-) X8.D-
N$107: U15.1(D+) X8.D+
N$108: D7.C S11.1 U15.4(SEL0)
N$109: D7.A S11.2 S11.4 U15.11(SEL1)
N$110: U16.2(D-) X9.D-
N$111: U16.1(D+) X9.D+
N$112: D8.C S12.1 U16.4(SEL0)
N$113: D8.A S12.2 S12.4 U16.11(SEL1)
N$114: U17.2(D-) X10.D-
N$115: U17.1(D+) X10.D+
N$116: D9.C S13.1 U17.4(SEL0)
N$117: D9.A S13.2 S13.4 U17.11(SEL1)
N$118: U18.2(D-) X11.D-
N$119: U18.1(D+) X11.D+
N$120: D10.C S14.1 U18.4(SEL0)
N$121: D10.A S14.2 S14.4 U18.11(SEL1)
N$122: U19.2(D-) X12.D-
N$123: U19.1(D+) X12.D+
N$124: D11.C S15.1 U19.4(SEL0)
N$125: D11.A S15.2 S15.4 U19.11(SEL1)
N$126: U20.2(D-) X13.D-
N$127: U20.1(D+) X13.D+
N$128: D12.C S16.1 U20.4(SEL0)
N$129: D12.A S16.2 S16.4 U20.11(SEL1)
N$130: J7.1 U21.2(1A)
N$131: J7.2 U21.4(2A)
N$132: U1.18(8A) U$3.5(CC1/VCONN)
N$133: U1.23(10A) U$3.3(SSTX-) U$3.B3(SSTX-)
N$134: U1.25(11A) U$3.2(SSTX+) U$3.B2(SSTX+)
N$135: U1.27(12A) U$3.1(GND) U$3.12(GND) U$3.B1(GND) U$3.B12(GND)
N$136: U1.2(1A) U$3.P$1(SHIELD) U$3.P$2(SHIELD) U$3.P$3(SHIELD) U$3.P$4(SHIELD) U$3.P$5(SHIELD) U$3.P$6(SHIELD) U$3.P$7(SHIELD) U$3.P$8(SHIELD) U$3.P$9(SHIELD) U$3.P$10(SHIELD) U$3.P$11(SHIELD) U$3.P$12(SHIELD) U$3.P$13(SHIELD) U$3.P$14(SHIELD) U$3.P$15(SHIELD) U$3.P$16(SHIELD) U$3.P$17(SHIELD) U$3.P$18(SHIELD) U$3.P$19(SHIELD) U$3.P$20(SHIELD) U$3.P$21(SHIELD) U$3.P$22(SHIELD) U$3.P$23(SHIELD) U$3.P$24(SHIELD) U$3.P$25(SHIELD) U$3.P$26(SHIELD) U$3.P$27(SHIELD) U$3.P$28(SHIELD)
N$137: U1.4(2A) U$3.B5(CC2/VCONN)
N$138: U1.15(7A) U$3.6(D+) U$3.B6(D+)
N$139: U1.13(6A) U$3.7(D-) U$3.B7(D-)
N$140: U1.11(5A) U$3.8(SBU) U$3.B8(SBU)
N$141: U1.9(4A) U$3.10(SSRX-) U$3.B10(SSRX-)
N$142: U1.6(3A) U$3.11(SSRX+) U$3.B11(SSRX+)
N$143: J7.3 U21.6(3A)
N$144: J7.4 U21.9(4A)
N$145: J7.5 U21.11(5A)
N$146: J7.6 U21.13(6A)
N$147: J7.7 U21.15(7A)
N$148: J7.8 U21.18(8A)
N$149: J7.9 U21.21(9A)
N$150: J7.10
N$151: J7.11
N$152: J7.12 U21.27(12A)
N$153: J7.13 U22.2(1A)
N$154: J7.14 U22.4(2A)
N$155: J7.15 U22.6(3A)
N$156: J7.16 U22.9(4A)
N$157: J7.17 U22.11(5A)
N$158: J7.18 U22.13(6A)
N$159: J7.19 U22.15(7A)
N$160: J7.SH1(SHIELD) J7.SH2(SHIELD) J7.SH3(SHIELD) J7.SH4(SHIELD) U22.21(9A)
N$161: J8.1 U23.2(1A)
N$162: J8.2 U23.4(2A)
N$163: J7.20 U22.18(8A)
N$164: J8.3 U23.6(3A)
N$165: J8.4 U23.9(4A)
N$166: J8.5 U23.11(5A)
N$167: J8.6 U23.13(6A)
N$168: J8.7 U23.15(7A)
N$169: J8.8 U23.18(8A)
N$170: J8.9 U23.21(9A)
N$171: J8.10
N$172: J8.11
N$173: J8.12 U23.27(12A)
N$174: J8.13 U24.2(1A)
N$175: J8.14 U24.4(2A)
N$176: J8.15 U24.6(3A)
N$177: J8.16 U24.9(4A)
N$178: J8.17 U24.11(5A)
N$179: J8.18 U24.13(6A)
N$180: J8.19 U24.15(7A)
N$181: J8.SH1(SHIELD) J8.SH2(SHIELD) J8.SH3(SHIELD) J8.SH4(SHIELD) U24.21(9A)
N$182: J8.20 U24.18(8A)
N$183: J9.1 U25.2(1A)
N$184: J9.2 U25.4(2A)
N$185: J9.3 U25.6(3A)
N$186: J9.4 U25.9(4A)
N$187: J9.5 U25.11(5A)
N$188: J9.6 U25.13(6A)
N$189: J9.7 U25.15(7A)
N$190: J9.8 U25.18(8A)
N$191: J9.9 U25.21(9A)
N$192: J9.10
N$193: J9.11
N$194: J9.12 U25.27(12A)
N$195: J9.13 U26.2(1A)
N$196: J9.14 U26.4(2A)
N$197: J9.15 U26.6(3A)
N$198: J9.16 U26.9(4A)
N$199: J9.17 U26.11(5A)
N$200: J9.18 U26.13(6A)
N$201: J9.19 U26.15(7A)
N$202: J9.SH1(SHIELD) J9.SH2(SHIELD) J9.SH3(SHIELD) J9.SH4(SHIELD) U26.21(9A)
N$203: J9.20 U26.18(8A)
N$204: J10.1 U27.2(1A)
N$205: J10.2 U27.4(2A)
N$206: J10.3 U27.6(3A)
N$207: J10.4 U27.9(4A)
N$208: J10.5 U27.11(5A)
N$209: J10.6 U27.13(6A)
N$210: J10.7 U27.15(7A)
N$211: J10.8 U27.18(8A)
N$212: J10.9 U27.21(9A)
N$213: J10.10
N$214: J10.11
N$215: J10.12 U27.27(12A)
N$216: J10.13 U28.2(1A)
N$217: J10.14 U28.4(2A)
N$218: J10.15 U28.6(3A)
N$219: J10.16 U28.9(4A)
N$220: J10.17 U28.11(5A)
N$221: J10.18 U28.13(6A)
N$222: J10.19 U28.15(7A)
N$223: J10.SH1(SHIELD) J10.SH2(SHIELD) J10.SH3(SHIELD) J10.SH4(SHIELD) U28.21(9A)
N$224: J10.20 U28.18(8A)
PC1A1: J11.RING2 J12.RING2
PC1A2: J11.TIP J12.TIP
PC1A3: J11.RING1 J12.RING1
PC1A4: J11.EARTH J12.EARTH
PC1D+: U9.6(HSD1+) U10.6(HSD1+) U11.6(HSD1+) U12.6(HSD1+) U13.6(HSD1+) U14.6(HSD1+) U15.6(HSD1+) U16.6(HSD1+) U17.6(HSD1+) U18.6(HSD1+) U19.6(HSD1+) U20.6(HSD1+) X2.D+
PC1D-: U9.5(HSD1-) U10.5(HSD1-) U11.5(HSD1-) U12.5(HSD1-) U13.5(HSD1-) U14.5(HSD1-) U15.5(HSD1-) U16.5(HSD1-) U17.5(HSD1-) U18.5(HSD1-) U19.5(HSD1-) U20.5(HSD1-) X2.D-
PC1DP1: J6.1 U21.54(1B1) U23.54(1B1) U25.54(1B1) U27.54(1B1)
PC1DP2: J6.2 U21.52(2B1) U23.52(2B1) U25.52(2B1) U27.52(2B1)
PC1DP3: J6.3 U21.50(3B1) U23.50(3B1) U25.50(3B1) U27.50(3B1)
PC1DP4: J6.4 U21.47(4B1) U23.47(4B1) U25.47(4B1) U27.47(4B1)
PC1DP5: J6.5 U21.45(5B1) U23.45(5B1) U25.45(5B1) U27.45(5B1)
PC1DP6: J6.6 U21.43(6B1) U23.43(6B1) U25.43(6B1) U27.43(6B1)
PC1DP7: J6.7 U21.41(7B1) U23.41(7B1) U25.41(7B1) U27.41(7B1)
PC1DP8: J6.8 U21.39(8B1) U23.39(8B1) U25.39(8B1) U27.39(8B1)
PC1DP9: J6.9 U21.36(9B1) U23.36(9B1) U25.36(9B1) U27.36(9B1)
PC1DP10: J6.10 U21.34(10B1) U23.34(10B1) U25.34(10B1) U27.34(10B1)
PC1DP11: J6.11 U21.32(11B1) U23.32(11B1) U25.32(11B1) U27.32(11B1)
PC1DP12: J6.12 U21.30(12B1) U23.30(12B1) U25.30(12B1) U27.30(12B1)
PC1DP13: J6.13 U22.54(1B1) U24.54(1B1) U26.54(1B1) U28.54(1B1)
PC1DP14: J6.14 U22.52(2B1) U24.52(2B1) U26.52(2B1) U28.52(2B1)
PC1DP15: J6.15 U22.50(3B1) U24.50(3B1) U26.50(3B1) U28.50(3B1)
PC1DP16: J6.16 U22.47(4B1) U24.47(4B1) U26.47(4B1) U28.47(4B1)
PC1DP17: J6.17 U22.45(5B1) U24.45(5B1) U26.45(5B1) U28.45(5B1)
PC1DP18: J6.18 U22.43(6B1) U24.43(6B1) U26.43(6B1) U28.43(6B1)
PC1DP19: J6.19 U22.41(7B1) U24.41(7B1) U26.41(7B1) U28.41(7B1)
PC1DP20: J6.20 U22.39(8B1) U24.39(8B1) U26.39(8B1) U28.39(8B1)
PC1DPS: J6.SH1(SHIELD) J6.SH2(SHIELD) J6.SH3(SHIELD) J6.SH4(SHIELD) U22.36(9B1) U24.36(9B1) U26.36(9B1) U28.36(9B1)
PC1HDMI-HOT: J1.19(HOTPLUGDETECT/HEAC-) U5.35(HPD1) U6.35(HPD1) U7.35(HPD1) U8.35(HPD1)
PC1HDMI-SCL: J1.15(SCL) U5.37(SCL1) U6.37(SCL1) U7.37(SCL1) U8.37(SCL1)
PC1HDMI-SDA: J1.16(SDA) U5.36(SDA1) U6.36(SDA1) U7.36(SDA1) U8.36(SDA1)
PC1HDMI-TMDS1+: J1.4(TMDSDATA1+) U5.45(D1+_1) U6.45(D1+_1) U7.45(D1+_1) U8.45(D1+_1)
PC1HDMI-TMDS1-: J1.6(TMDSDATA1-) U5.44(D1-_1) U6.44(D1-_1) U7.44(D1-_1) U8.44(D1-_1)
PC1HDMI-TMDSC+: J1.10(TMDSCLOCK+) U5.39(CLK+_1) U6.39(CLK+_1) U7.39(CLK+_1) U8.39(CLK+_1)
PC1HDMI-TMDSC-: J1.12(TMDSCLOCK-) U5.38(CLK-_1) U6.38(CLK-_1) U7.38(CLK-_1) U8.38(CLK-_1)
PC1HDMI-TMDSD0+: J1.7(TMDSDATA0+) U5.42(D0+_1) U6.42(D0+_1) U7.42(D0+_1) U8.42(D0+_1)
PC1HDMI-TMDSD0-: J1.9(TMDSDATA0-) U5.41(D0-_1) U6.41(D0-_1) U7.41(D0-_1) U8.41(D0-_1)
PC1HDMI-TMDSD2+: J1.1(TMDSDATA2+) U5.48(D2+_1) U6.48(D2+_1) U7.48(D2+_1) U8.48(D2+_1)
PC1HDMI-TMDSD2-: J1.3(TMDSDATA2-) U5.47(D2-_1) U6.47(D2-_1) U7.47(D2-_1) U8.47(D2-_1)
PC1USBC-CC1: U1.39(8B1) U2.39(8B1) U3.39(8B1) U4.39(8B1) U$1.5(CC1/VCONN)
PC1USBC-CC2: U1.52(2B1) U2.52(2B1) U3.52(2B1) U4.52(2B1) U$1.B5(CC2/VCONN)
PC1USBC-D+: U1.41(7B1) U2.41(7B1) U3.41(7B1) U4.41(7B1) U$1.6(D+) U$1.B6(D+)
PC1USBC-D-: U1.43(6B1) U2.43(6B1) U3.43(6B1) U4.43(6B1) U$1.7(D-) U$1.B7(D-)
PC1USBC-GND: U1.30(12B1) U2.30(12B1) U3.30(12B1) U4.30(12B1) U$1.1(GND) U$1.12(GND) U$1.B1(GND) U$1.B12(GND)
PC1USBC-SBU: U1.45(5B1) U2.45(5B1) U3.45(5B1) U4.45(5B1) U$1.8(SBU) U$1.B8(SBU)
PC1USBC-SHIELD: U1.54(1B1) U2.54(1B1) U3.54(1B1) U4.54(1B1) U$1.P$1(SHIELD) U$1.P$2(SHIELD) U$1.P$3(SHIELD) U$1.P$4(SHIELD) U$1.P$5(SHIELD) U$1.P$6(SHIELD) U$1.P$7(SHIELD) U$1.P$8(SHIELD) U$1.P$9(SHIELD) U$1.P$10(SHIELD) U$1.P$11(SHIELD) U$1.P$12(SHIELD) U$1.P$13(SHIELD) U$1.P$14(SHIELD) U$1.P$15(SHIELD) U$1.P$16(SHIELD) U$1.P$17(SHIELD) U$1.P$18(SHIELD) U$1.P$19(SHIELD) U$1.P$20(SHIELD) U$1.P$21(SHIELD) U$1.P$22(SHIELD) U$1.P$23(SHIELD) U$1.P$24(SHIELD) U$1.P$25(SHIELD) U$1.P$26(SHIELD) U$1.P$27(SHIELD) U$1.P$28(SHIELD)
PC1USBC-SSRX+: U1.50(3B1) U2.50(3B1) U3.50(3B1) U4.50(3B1) U$1.11(SSRX+) U$1.B11(SSRX+)
PC1USBC-SSRX-: U1.47(4B1) U2.47(4B1) U3.47(4B1) U4.47(4B1) U$1.10(SSRX-) U$1.B10(SSRX-)
PC1USBC-SSTX+: U1.32(11B1) U2.32(11B1) U3.32(11B1) U4.32(11B1) U$1.2(SSTX+) U$1.B2(SSTX+)
PC1USBC-SSTX-: U1.34(10B1) U2.34(10B1) U3.34(10B1) U4.34(10B1) U$1.3(SSTX-) U$1.B3(SSTX-)
PC1USBC-VBUS: U1.36(9B1) U2.36(9B1) U3.36(9B1) U4.36(9B1) U$1.4(VBUS) U$1.9(VBUS) U$1.B4(VBUS) U$1.B9(VBUS)
PC2D+: U9.8(HSD2+) U10.8(HSD2+) U11.8(HSD2+) U12.8(HSD2+) U13.8(HSD2+) U14.8(HSD2+) U15.8(HSD2+) U16.8(HSD2+) U17.8(HSD2+) U18.8(HSD2+) U19.8(HSD2+) U20.8(HSD2+)
PC2D-: U9.7(HSD2-) U10.7(HSD2-) U11.7(HSD2-) U12.7(HSD2-) U13.7(HSD2-) U14.7(HSD2-) U15.7(HSD2-) U16.7(HSD2-) U17.7(HSD2-) U18.7(HSD2-) U19.7(HSD2-) U20.7(HSD2-)
PC2DP1: U21.53(1B2) U23.53(1B2) U25.53(1B2) U27.53(1B2)
PC2DP2: U21.51(2B2) U23.51(2B2) U25.51(2B2) U27.51(2B2)
PC2DP3: U21.48(3B2) U23.48(3B2) U25.48(3B2) U27.48(3B2)
PC2DP4: U21.46(4B2) U23.46(4B2) U25.46(4B2) U27.46(4B2)
PC2DP5: U21.44(5B2) U23.44(5B2) U25.44(5B2) U27.44(5B2)
PC2DP6: U21.42(6B2) U23.42(6B2) U25.42(6B2) U27.42(6B2)
PC2DP7: U21.40(7B2) U23.40(7B2) U25.40(7B2) U27.40(7B2)
PC2DP8: U21.37(8B2) U23.37(8B2) U25.37(8B2) U27.37(8B2)
PC2DP9: U21.35(9B2) U23.35(9B2) U25.35(9B2) U27.35(9B2)
PC2DP10: U21.33(10B2) U23.33(10B2) U25.33(10B2) U27.33(10B2)
PC2DP11: U21.31(11B2) U23.31(11B2) U25.31(11B2) U27.31(11B2)
PC2DP12: U21.29(12B2) U23.29(12B2) U25.29(12B2) U27.29(12B2)
PC2DP13: U22.53(1B2) U24.53(1B2) U26.53(1B2) U28.53(1B2)
PC2DP14: U22.51(2B2) U24.51(2B2) U26.51(2B2) U28.51(2B2)
PC2DP15: U22.48(3B2) U24.48(3B2) U26.48(3B2) U28.48(3B2)
PC2DP16: U22.46(4B2) U24.46(4B2) U26.46(4B2) U28.46(4B2)
PC2DP17: U22.44(5B2) U24.44(5B2) U26.44(5B2) U28.44(5B2)
PC2DP18: U22.42(6B2) U24.42(6B2) U26.42(6B2) U28.42(6B2)
PC2DP19: U22.40(7B2) U24.40(7B2) U26.40(7B2) U28.40(7B2)
PC2DP20: U22.37(8B2) U24.37(8B2) U26.37(8B2) U28.37(8B2)
PC2DPS: U22.35(9B2) U24.35(9B2) U26.35(9B2) U28.35(9B2)
PC2HDMI-HOT: U5.50(HPD2) U6.50(HPD2) U7.50(HPD2) U8.50(HPD2)
PC2HDMI-SCL: U5.2(SCL3) U6.2(SCL3) U7.2(SCL3) U8.2(SCL3)
PC2HDMI-SDA: U5.51(SDA2) U6.51(SDA2) U7.51(SDA2) U8.51(SDA2)
PC2HDMI-TMDS1+: U5.60(D1+_2) U6.60(D1+_2) U7.60(D1+_2) U8.60(D1+_2)
PC2HDMI-TMDS1-: U5.59(D1-_2) U6.59(D1-_2) U7.59(D1-_2) U8.59(D1-_2)
PC2HDMI-TMDSC+: U5.54(CLK+_2) U6.54(CLK+_2) U7.54(CLK+_2) U8.54(CLK+_2)
PC2HDMI-TMDSC-: U5.53(CLK-_2) U6.53(CLK-_2) U7.53(CLK-_2) U8.53(CLK-_2)
PC2HDMI-TMDSD0+: U5.57(D0+_2) U6.57(D0+_2) U7.57(D0+_2) U8.57(D0+_2)
PC2HDMI-TMDSD0-: U5.56(D0-_2) U6.56(D0-_2) U7.56(D0-_2) U8.56(D0-_2)
PC2HDMI-TMDSD2+: U5.63(D2+_2) U6.63(D2+_2) U7.63(D2+_2) U8.63(D2+_2)
PC2HDMI-TMDSD2-: U5.62(D2-_2) U6.62(D2-_2) U7.62(D2-_2) U8.62(D2-_2)
PC2USBC-CC1: U1.37(8B2) U2.37(8B2) U3.37(8B2) U4.37(8B2)
PC2USBC-CC2: U1.51(2B2) U2.51(2B2) U3.51(2B2) U4.51(2B2)
PC2USBC-D+: U1.40(7B2) U2.40(7B2) U3.40(7B2) U4.40(7B2)
PC2USBC-D-: U1.42(6B2) U2.42(6B2) U3.42(6B2) U4.42(6B2)
PC2USBC-GND: U1.29(12B2) U2.29(12B2) U3.29(12B2) U4.29(12B2)
PC2USBC-SBU: U1.44(5B2) U2.44(5B2) U3.44(5B2) U4.44(5B2)
PC2USBC-SHIELD: U1.53(1B2) U2.53(1B2) U3.53(1B2) U4.53(1B2)
PC2USBC-SSRX+: U1.48(3B2) U2.48(3B2) U3.48(3B2) U4.48(3B2)
PC2USBC-SSRX-: U1.46(4B2) U2.46(4B2) U3.46(4B2) U4.46(4B2)
PC2USBC-SSTX+: U1.31(11B2) U2.31(11B2) U3.31(11B2) U4.31(11B2)
PC2USBC-SSTX-: U1.33(10B2) U2.33(10B2) U3.33(10B2) U4.33(10B2)
PC2USBC-VBUS: U1.35(9B2) U2.35(9B2) U3.35(9B2) U4.35(9B2)
PC3D+: U9.10(HSD3+) U10.10(HSD3+) U11.10(HSD3+) U12.10(HSD3+) U13.10(HSD3+) U14.10(HSD3+) U15.10(HSD3+) U16.10(HSD3+) U17.10(HSD3+) U18.10(HSD3+) U19.10(HSD3+) U20.10(HSD3+)
PC3D-: U9.9(HSD3-) U10.9(HSD3-) U11.9(HSD3-) U12.9(HSD3-) U13.9(HSD3-) U14.9(HSD3-) U15.9(HSD3-) U16.9(HSD3-) U17.9(HSD3-) U18.9(HSD3-) U19.9(HSD3-) U20.9(HSD3-)
PC3DP1: U21.3(1B3) U23.3(1B3) U25.3(1B3) U27.3(1B3)
PC3DP2: U21.5(2B3) U23.5(2B3) U25.5(2B3) U27.5(2B3)
PC3DP3: U21.7(3B3) U23.7(3B3) U25.7(3B3) U27.7(3B3)
PC3DP4: U21.10(4B3) U23.10(4B3) U25.10(4B3) U27.10(4B3)
PC3DP5: U21.12(5B3) U23.12(5B3) U25.12(5B3) U27.12(5B3)
PC3DP6: U21.14(6B3) U23.14(6B3) U25.14(6B3) U27.14(6B3)
PC3DP7: U21.16(7B3) U23.16(7B3) U25.16(7B3) U27.16(7B3)
PC3DP8: U21.20(8B3) U23.20(8B3) U25.20(8B3) U27.20(8B3)
PC3DP9: U21.22(9B3) U23.22(9B3) U25.22(9B3) U27.22(9B3)
PC3DP10: U21.24(10B3) U23.24(10B3) U25.24(10B3) U27.24(10B3)
PC3DP11: U21.26(11B3) U23.26(11B3) U25.26(11B3) U27.26(11B3)
PC3DP12: U21.28(12B3) U23.28(12B3) U25.28(12B3) U27.28(12B3)
PC3DP13: U22.3(1B3) U24.3(1B3) U26.3(1B3) U28.3(1B3)
PC3DP14: U22.5(2B3) U24.5(2B3) U26.5(2B3) U28.5(2B3)
PC3DP15: U22.7(3B3) U24.7(3B3) U26.7(3B3) U28.7(3B3)
PC3DP16: U22.10(4B3) U24.10(4B3) U26.10(4B3) U28.10(4B3)
PC3DP17: U22.12(5B3) U24.12(5B3) U26.12(5B3) U28.12(5B3)
PC3DP18: U22.14(6B3) U24.14(6B3) U26.14(6B3) U28.14(6B3)
PC3DP19: U22.16(7B3) U24.16(7B3) U26.16(7B3) U28.16(7B3)
PC3DP20: U22.20(8B3) U24.20(8B3) U26.20(8B3) U28.20(8B3)
PC3DPS: U22.22(9B3) U24.22(9B3) U26.22(9B3) U28.22(9B3)
PC3HDMI-HOT: U5.64(HPD3) U6.64(HPD3) U7.64(HPD3) U8.64(HPD3)
PC3HDMI-SCL: U5.52(SCL2) U6.52(SCL2) U7.52(SCL2) U8.52(SCL2)
PC3HDMI-SDA: U5.1(SDA3) U6.1(SDA3) U7.1(SDA3) U8.1(SDA3)
PC3HDMI-TMDS1+: U5.11(D1+_3) U6.11(D1+_3) U7.11(D1+_3) U8.11(D1+_3)
PC3HDMI-TMDS1-: U5.10(D1-_3) U6.10(D1-_3) U7.10(D1-_3) U8.10(D1-_3)
PC3HDMI-TMDSC+: U5.5(CLK+_3) U6.5(CLK+_3) U7.5(CLK+_3) U8.5(CLK+_3)
PC3HDMI-TMDSC-: U5.4(CLK-_3) U6.4(CLK-_3) U7.4(CLK-_3) U8.4(CLK-_3)
PC3HDMI-TMDSD0+: U5.8(D0+_3) U6.8(D0+_3) U7.8(D0+_3) U8.8(D0+_3)
PC3HDMI-TMDSD0-: U5.7(D0-_3) U6.7(D0-_3) U7.7(D0-_3) U8.7(D0-_3)
PC3HDMI-TMDSD2+: U5.14(D2+_3) U6.14(D2+_3) U7.14(D2+_3) U8.14(D2+_3)
PC3HDMI-TMDSD2-: U5.13(D2-_3) U6.13(D2-_3) U7.13(D2-_3) U8.13(D2-_3)
PC3USBC-CC1: U1.20(8B3) U2.20(8B3) U3.20(8B3) U4.20(8B3)
PC3USBC-CC2: U1.5(2B3) U2.5(2B3) U3.5(2B3) U4.5(2B3)
PC3USBC-D+: U1.16(7B3) U2.16(7B3) U3.16(7B3) U4.16(7B3)
PC3USBC-D-: U1.14(6B3) U2.14(6B3) U3.14(6B3) U4.14(6B3)
PC3USBC-GND: U1.28(12B3) U2.28(12B3) U3.28(12B3) U4.28(12B3)
PC3USBC-SBU: U1.12(5B3) U2.12(5B3) U3.12(5B3) U4.12(5B3)
PC3USBC-SHIELD: U1.3(1B3) U2.3(1B3) U3.3(1B3) U4.3(1B3)
PC3USBC-SSRX+: U1.7(3B3) U2.7(3B3) U3.7(3B3) U4.7(3B3)
PC3USBC-SSRX-: U1.10(4B3) U2.10(4B3) U3.10(4B3) U4.10(4B3)
PC3USBC-SSTX+: U1.26(11B3) U2.26(11B3) U3.26(11B3) U4.26(11B3)
PC3USBC-SSTX-: U1.24(10B3) U2.24(10B3) U3.24(10B3) U4.24(10B3)
PC3USBC-VBUS: U1.22(9B3) U2.22(9B3) U3.22(9B3) U4.22(9B3)
SCL: J2.15(SCL) J3.15(SCL) J4.15(SCL) J5.15(SCL) U5.29(SCL_SINK) U6.29(SCL_SINK) U7.29(SCL_SINK) U8.29(SCL_SINK)
SDA: J2.16(SDA) J3.16(SDA) J4.16(SDA) J5.16(SDA) U5.30(SDA_SINK) U6.30(SDA_SINK) U7.30(SDA_SINK) U8.30(SDA_SINK)
USBGND: U9.3(GND) U10.3(GND) U11.3(GND) U12.3(GND) U13.3(GND) U14.3(GND) U15.3(GND) U16.3(GND) U17.3(GND) U18.3(GND) U19.3(GND) U20.3(GND) X1.GND X2.GND X3.GND X4.GND X5.GND X6.GND X7.GND X8.GND X9.GND X10.GND X11.GND X12.GND X13.GND
USBVCC: S5.3 S6.3 S7.3 S8.3 S9.3 S10.3 S11.3 S12.3 S13.3 S14.3 S15.3 S16.3 U9.12(VCC) U10.12(VCC) U11.12(VCC) U12.12(VCC) U13.12(VCC) U14.12(VCC) U15.12(VCC) U16.12(VCC) U17.12(VCC) U18.12(VCC) U19.12(VCC) U20.12(VCC) X1.VBUS X2.VBUS X3.VBUS X4.VBUS X5.VBUS X6.VBUS X7.VBUS X8.VBUS X9.VBUS X10.VBUS X11.VBUS X12.VBUS X13.VBUS
VBUS: U1.21(9A) U2.21(9A) U3.21(9A) U4.21(9A) U$2.4(VBUS) U$2.9(VBUS) U$2.B4(VBUS) U$2.B9(VBUS) U$3.4(VBUS) U$3.9(VBUS) U$3.B4(VBUS) U$3.B9(VBUS) U$4.4(VBUS) U$4.9(VBUS) U$4.B4(VBUS) U$4.B9(VBUS) U$5.4(VBUS) U$5.9(VBUS) U$5.B4(VBUS) U$5.B9(VBUS)
Unconnected: S17.1 S17.2 S17.3 S17.4 S18.1 S18.2 S18.3 S18.4 S19.1 S19.2 S19.3 S19.4 S20.1 S20.2 S20.3 S20.4 U5.16(VSADJ) U5.32(S1/SCL) U5.33(S2/SDA) U5.34(I2C_SEL) U5.49(~LP) U6.16(VSADJ) U6.32(S1/SCL) U6.33(S2/SDA) U6.34(I2C_SEL) U6.49(~LP) U7.16(VSADJ) U7.32(S1/SCL) U7.33(S2/SDA) U7.34(I2C_SEL) U7.49(~LP) U8.16(VSADJ) U8.32(S1/SCL) U8.33(S2/SDA) U8.34(I2C_SEL) U8.49(~LP) U21.1(SO) U21.55(S2) U21.56(S1) U22.1(SO) U22.23(10A) U22.24(10B3) U22.25(11A) U22.26(11B3) U22.27(12A) U22.28(12B3) U22.29(12B2) U22.30(12B1) U22.31(11B2) U22.32(11B1) U22.33(10B2) U22.34(10B1) U22.55(S2) U22.56(S1) U23.1(SO) U23.55(S2) U23.56(S1) U24.1(SO) U24.23(10A) U24.24(10B3) U24.25(11A) U24.26(11B3) U24.27(12A) U24.28(12B3) U24.29(12B2) U24.30(12B1) U24.31(11B2) U24.32(11B1) U24.33(10B2) U24.34(10B1) U24.55(S2) U24.56(S1) U25.1(SO) U25.55(S2) U25.56(S1) U26.1(SO) U26.23(10A) U26.24(10B3) U26.25(11A) U26.26(11B3) U26.27(12A) U26.28(12B3) U26.29(12B2) U26.30(12B1) U26.31(11B2) U26.32(11B1) U26.33(10B2) U26.34(10B1) U26.55(S2) U26.56(S1) U27.1(SO) U27.55(S2) U27.56(S1) U28.1(SO) U28.23(10A) U28.24(10B3) U28.25(11A) U28.26(11B3) U28.27(12A) U28.28(12B3) U28.29(12B2) U28.30(12B1) U28.31(11B2) U28.32(11B1) U28.33(10B2) U28.34(10B1) U28.55(S2) U28.56(S1)

## Buses
I2C:SCL,SDA
B$1
B$2

## Notes on the sheet
- USB A | USB A | USB A | USB Type C IN/OUT | USB Type C IN/OUT
- ETHERNET | ETHERNET | ETHERNET | ETHERNET
- PC1
- ETHERNET | ETHERNET | ETHERNET | ETHERNET
- USB A | USB A | USB A
- ETHERNET | ETHERNET | ETHERNET | ETHERNET
- USB A | USB A | USB A
- USB A | USB A | USB A
- USB Type C IN/OUT | USB Type C IN/OUT
- DP | DP | HDMI | HDMI
- DP | DP | HDMI | HDMI

## Power pins joined to a net without a drawn wire
GND: U21.19(GND) U22.19(GND) U23.19(GND) U24.19(GND) U25.19(GND) U26.19(GND) U27.19(GND) U28.19(GND)
GND-1: U21.38(GND-1) U22.38(GND-1) U23.38(GND-1) U24.38(GND-1) U25.38(GND-1) U26.38(GND-1) U27.38(GND-1) U28.38(GND-1)
GND-2: U21.49(GND-2) U22.49(GND-2) U23.49(GND-2) U24.49(GND-2) U25.49(GND-2) U26.49(GND-2) U27.49(GND-2) U28.49(GND-2)
GND-3: U21.8(GND-3) U22.8(GND-3) U23.8(GND-3) U24.8(GND-3) U25.8(GND-3) U26.8(GND-3) U27.8(GND-3) U28.8(GND-3)
VCC: U21.17(VCC) U22.17(VCC) U23.17(VCC) U24.17(VCC) U25.17(VCC) U26.17(VCC) U27.17(VCC) U28.17(VCC)

## Library data of the parts
D1-D12 = SparkFun-LED:LED: LED (Generic) Standard schematic elements and footprints for 5mm, 3mm, 1206, and 0603 sized LEDs. Generic LEDs with no color specified.
J1-J5 = Wurth_Elektronik_Electromechanic_Input-Output_Connectors_rev17b:685119134923: WR-COM SMT Horizontal HDMI, 19 pins=>Code : Con_I-O_COM_HDMI_685119134923 <http://katalog.we-online.de/media/images/eican/Con_I-O_COM_HDMI_685119134923_pf2.jpg> Details see: http://katalog.we-online.de/en/em/COM_SMT_HORIZONTAL/685119134923 Created 2014-07-09, Karrer Zheng 2014 (C) Würth Elektronik
J6-J10 = 2040210-1:2040210-1: Conn Display Port RCP 20 POS 0.5mm Solder RA Thru-Hole 20 Terminal 1 Port Tray; AVAILABILITY: Good; DESCRIPTION: Conn Display Port RCP 20 POS 0.5mm Solder RA Thru-Hole 20 Terminal 1 Port Tray; MF: TE Connectivity; MP: 2040210-1; PACKAGE: None; PRICE: 1.36 USD
J11 J12 = SparkFun-Connectors:AUDIO_JACK_TRRS: Audio Jack - 3.5mm TRRS (SMD) This is a 3.5mm TRRS SMD audio jack. TRRS connectors are the audio-style connectors that you see on some phones, MP3 players and development boards. TRRS stands for “tip, ring, ring, sleeve,” which reflects that this has three conductors and a ground. SparkFun Products: Audio Jack <https://www.sparkfun.com/products/12639> mbed Starter Kit <https://www.sparkfun.com/products/12968> SparkFun TRRS 3.5mm Jack Breakout <https://www.sparkfun.com/products/11570>; PROD_ID: CONN-10676; SF_ID: PRT-12639
S1-S20 = SparkFun-Switches:SWITCH-SP3T: Single-Pole, Triple-Throw (SP3T) Switch Single-Pole, Triple-Throw switches SparkFun Products Prototype Part; PROD_ID: SWCH-10805
U1-U4 U21-U28 = SN74CBT16214DGGR:SN74CBT16214DGGR: None; AVAILABILITY: Good; DESCRIPTION: Multiplexer/Demultiplexer Bus Switch 1-Element CMOS 36-IN 56-Pin TSSOP T/R; MF: Texas Instruments; MP: SN74CBT16214DGGR; PACKAGE: TSSOP-56 Texas Instruments; PRICE: 1.31 USD
U5-U8 = TMDS361BPAG:TMDS361BPAG: Three-Port HDMI Switch; AVAILABILITY: Good; DESCRIPTION: Ic Switch Dvi/Hdmi 3: 1 64-Tqfp - Tmds361bpag; MF: Texas Instruments; MP: TMDS361BPAG; PACKAGE: TQFP-64 Texas Instruments; PRICE: 3.46 USD
U9-U20 = FSUSB63UMX:FSUSB63UMX: Analog Switch Single SP3T 12-Pin UMLP T/R; AVAILABILITY: Good; DESCRIPTION: 3: 1 High-Speed - USB Switch / Multiplexer; MF: ON Semiconductor; MP: FSUSB63UMX; PACKAGE: UFQFN-12 ON Semiconductor; PRICE: 0.68 USD
U$1-U$5 = lio:USB-TYPE-C
U$6 U$19-U$30 = SparkFun:RJ45-8: RJ45 Jack Simple RJ45, 8-pin connection - connector for common Cat5, Cat5e, and Cat6 Ethernet cables. Footprint not yet proven in production. Connector sku is PRT-00643; Breakout PCB sku is BOB-00716.
X1-X13 = SparkFun:USB: USB Connectors USB-B-PTH is fully proven SKU : PRT-00139 USB-miniB is fully proven SKU : PRT-00587 USB-A-PCB is untested. USB-A-H is throughly reviewed, but untested. Spark Fun Electronics SKU : PRT-00437 USB-B-SMT is throughly reviewed, but untested. Needs silkscreen touching up. USB-A-S has not been used/tested USB-MB-H has not been used/tested